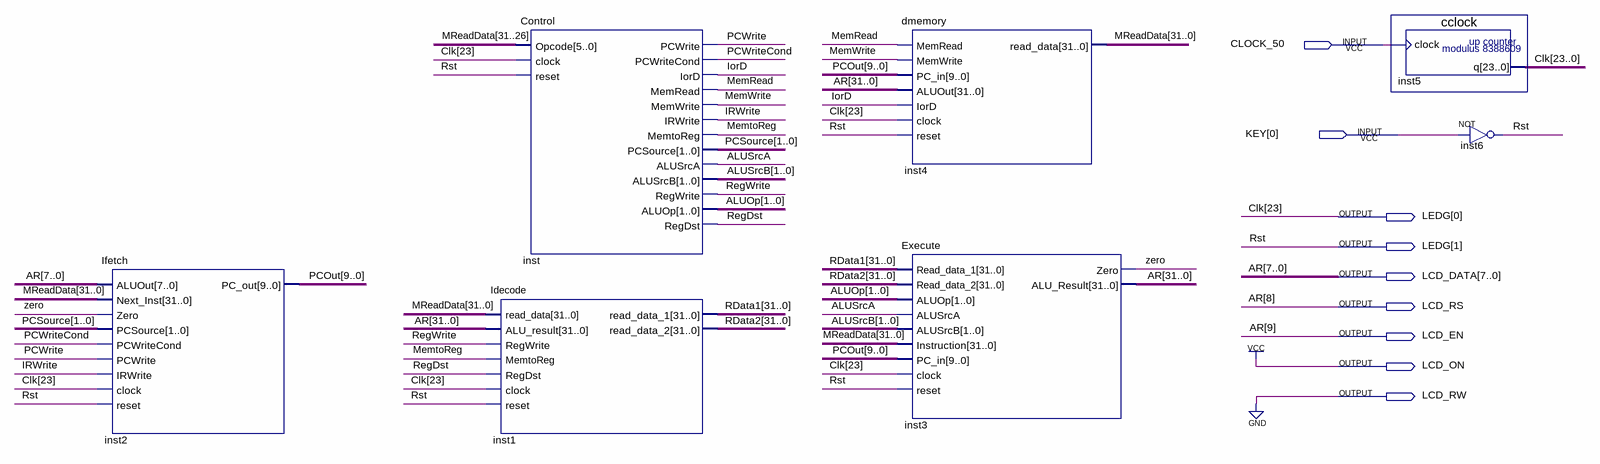
[diagram p0: schematic sheet]
// Quartus schematic MIPS.bdf as structural Verilog: 7 symbols, 9 pins
module MIPS (
  input  CLOCK_50,
  input  [0:0] KEY,
  output [1:0] LEDG,
  output [7:0] LCD_DATA,
  output LCD_RS,
  output LCD_EN,
  output LCD_ON,
  output LCD_RW
);

  wire ALUSrcA, IorD, IRWrite, MemRead, MemtoReg, MemWrite, PCWrite, PCWriteCond, RegDst, RegWrite, zero;
  wire [1:0] ALUOp, ALUSrcB, PCSource;
  wire [9:0] PCOut;
  wire [22:0] Clk;
  wire [31:0] MReadData, RData1, RData2;
  wire [31:10] AR;

  Ifetch inst2 (
    .ALUOut(LCD_DATA), .Next_Inst(MReadData), .Zero(zero), .PCSource(PCSource), .PCWriteCond(PCWriteCond),
    .PCWrite(PCWrite), .IRWrite(IRWrite), .clock(LEDG[0]), .reset(LEDG[1]), .PC_out(PCOut));
  Control inst (
    .Opcode(MReadData[31:26]), .clock(LEDG[0]), .reset(LEDG[1]), .PCWrite(PCWrite),
    .PCWriteCond(PCWriteCond), .IorD(IorD), .MemRead(MemRead), .MemWrite(MemWrite), .IRWrite(IRWrite),
    .MemtoReg(MemtoReg), .PCSource(PCSource), .ALUSrcA(ALUSrcA), .ALUSrcB(ALUSrcB), .RegWrite(RegWrite),
    .ALUOp(ALUOp), .RegDst(RegDst));
  Idecode inst1 (
    .read_data(MReadData), .ALU_result({AR, LCD_EN, LCD_RS, LCD_DATA}), .RegWrite(RegWrite),
    .MemtoReg(MemtoReg), .RegDst(RegDst), .clock(LEDG[0]), .reset(LEDG[1]), .read_data_1(RData1),
    .read_data_2(RData2));
  dmemory inst4 (
    .MemRead(MemRead), .MemWrite(MemWrite), .PC_in(PCOut), .ALUOut({AR, LCD_EN, LCD_RS, LCD_DATA}),
    .IorD(IorD), .clock(LEDG[0]), .reset(LEDG[1]), .read_data(MReadData));
  Execute inst3 (
    .Read_data_1(RData1), .Read_data_2(RData2), .ALUOp(ALUOp), .ALUSrcA(ALUSrcA), .ALUSrcB(ALUSrcB),
    .Instruction(MReadData), .PC_in(PCOut), .clock(LEDG[0]), .reset(LEDG[1]), .Zero(zero),
    .ALU_Result({AR, LCD_EN, LCD_RS, LCD_DATA}));
  cclock inst5 (.clock(CLOCK_50), .q({LEDG[0], Clk}));
  not inst6 (LEDG[1], KEY[0]);

  assign LCD_ON = 1'b1;
  assign LCD_RW = 1'b0;

  // Other names for the same wires on the sheet: AR[9:0] = {LCD_EN, LCD_RS, LCD_DATA}; Clk[23] = LEDG[0];
  //   Rst = LEDG[1]
endmodule
